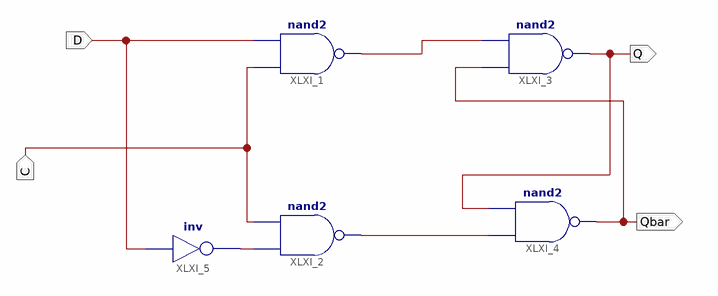
[diagram p0: schematic sheet 1]
// Xilinx ISE schematic D_LATCH.sch (kintex7) as structural Verilog: 5 symbols, 4 ports
module D_LATCH (
  input  C,
  input  D,
  output Q,
  output Qbar
);

  wire XLXN_4, XLXN_5, XLXN_6;

  nand XLXI_1 (XLXN_4, C, D);
  nand XLXI_2 (XLXN_5, XLXN_6, C);
  nand XLXI_3 (Q, Qbar, XLXN_4);
  nand XLXI_4 (Qbar, XLXN_5, Q);
  not XLXI_5 (XLXN_6, D);
endmodule
